# EAGLE design Whistler_Schematic_RevE (EAGLE 7.7.0)
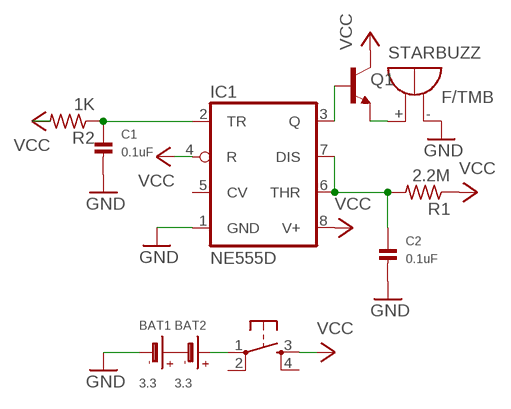
[diagram p0: schematic, sheet 1]

## Parts
BAT1  3.3  BATTERYCR1220_SMT  [CR1220]
BAT2  3.3  BATTERYCR1220_SMT  [CR1220]
C1  0.1uF  CAP_CERAMIC_0805  [_0805]
C2  0.1uF  CAP_CERAMIC_0805  [_0805]
IC1  NE555D  [SO08]
Q1  TRANS_NPN-MMBT2222AL  [SOT23-3]
R1  2.2M  R-US_R1206  [R1206]
R2  1K  R-US_R1206  [R1206]
S2  TAC_SWITCHSMD  [TACTILE-SWITCH-SMD]
STARBUZZ  F/TMB  [F/TMB]

## Nets
GND: BAT1.- C1.2 C2.2 IC1.1(GND) STARBUZZ.-
N$1: C2.1 IC1.6(THR) IC1.7(DIS) R1.2
N$2: C1.1 IC1.2(TR) R2.1
N$3: BAT1.+$1(+) BAT2.-
N$4: IC1.3(Q) Q1.1(B)
N$5: BAT2.+$1(+) S2.1
N$7: Q1.2(E) STARBUZZ.+
VCC: IC1.4(R) IC1.8(V+) Q1.3(C) R1.1 R2.2 S2.3
Unconnected: IC1.5(CV) S2.2 S2.4

## Library data of the parts
BAT1 BAT2 = microbuilder:BATTERY: CR1220 SMT - Digikey: 3001K-ND
C1 C2 = microbuilder:CAP_CERAMIC: Ceramic Capacitors 0402 - 0402 Surface Mount Capacitors 16pF 50V 5% [Digikey: 445-4899-2-ND] 18pF 50V 5% [Digikey: 490-1281-2-ND] 22pF 50V 5% [Digikey: 490-1283-2-ND] 68pF 50V 5% [Digikey: 490-1289-2-ND] 0.1uF 10V 10% [Digikey: 490-1318-2-ND] 1.0uF 6.3V 10% [Digikey: 490-1320-2-ND] 0603 - 0603 Surface Mount Capacitors 16 pF 50V 5% [Digikey: 445-5051-2-ND] 22 pF 50V [Digikey: PCC220ACVTR-ND] 33 pF 50V 5% [Digikey: 490-1415-1-ND] 56pF 50V 5% [Digikey: 490-1421-1-ND] 220pF 50V 5% [Digikey: 445-1285-1-ND] 680 pF 50V 2200 pF 50V 5% C0G [Digikey: 445-1297-1-ND] 5600 pF 100V 5% X7R [Digikey: 478-3711-1-ND] 0.1 µF 25V 10% [Digikey: PCC2277TR-ND] 0.22 µF 16V 10% X7R [Digikey: 445-1318-1-ND] 1.0 µF 25V 10% [Digikey: 445-5146-2-ND] 0603 - RF Specific 3pF 250V +/-0.1pF RF [Digikey: 712-1347-1-ND] 18 pF 250V 5% [Digikey: 478-3505-1-ND or 712-1322-1-ND] 56 pF 250V 5% C0G RF [Digikey: 490-4867-1-ND] 68 pF 250V RF [Digikey: 490-4868-1-ND] 0805 - 0805 Surface Mount Capacitors 220 pF 250V 2% RF Ceramic Capacitor [Digikey: 712-1398-1-ND] 1000 pF 50V 2% NP0 Ceramic Capacitor [Digikey: 478-3760-1-ND] 0.1 µF 25V 10% Ceramic Capacitor [Digikey: PCC1828TR-ND] 1.0 µF 16V 10% Ceramic Capacitor[Digikey: 490-1691-2-ND] 10.0 µF 10V 10% Ceramic Capacitor[Digikey: 709-1228-1-ND] 10.0 uF 16V 10% Ceramic Capacitor [Digikey: 478-5165-2-ND] 47 uF 6.3V 20% Ceramic Capacitor [Digikey: 587-1779-1-ND or 399-5506-1-ND] 1206 - 1206 Surface Mount Capacitors 47uF 10V 20% Ceramic Capacitor [Digikey: 490-5528-1-ND or 399-5508-1-ND or 445-6010-1-ND] 100uF 6.3V -20%, +80% Y5V Ceramic Capacitor (Digikey: 490-4512-1-ND, Mouser: 81-GRM31CF50J107ZE1L)
IC1 = linear:*555: TIMER
Q1 = SparkFun-DiscreteSemi:TRANS_NPN: NPN transistor Current controlled devices typically used to amplify current or used as a switch. BC547 - COM-08928 <http://www.sparkfun.com/products/8928> (TO-92 45V 100mA) (1.Collector 2.Base 3.Emitter) 2N3904 - COM-00521 <http://www.sparkfun.com/products/521> (TO-92 40V 200mA) (1.Emitter 2.Base 3.Collector) P2N2222A - COM-12852 <http://www.sparkfun.com/products/12852> (TO-92 40V 600mA) (1.Collector 2.Base 3.Emitter); PROD_ID: TRANS-08049; VALUE: 600mA/40V
R1 R2 = rcl:R-US_: RESISTOR, American symbol
S2 = SparkFun-Retired:TAC_SWITCH: Momentary Switch Button commonly used for reset or general input. Spark Fun Electronics SKU : COM-00097 SMT- SWCH-08247; PROD_ID: SWCH-08247
STARBUZZ = buzzer:F/TMB: BUZZER Source: Buerklin; OC_FARNELL: unknown; OC_NEWARK: unknown

## Board
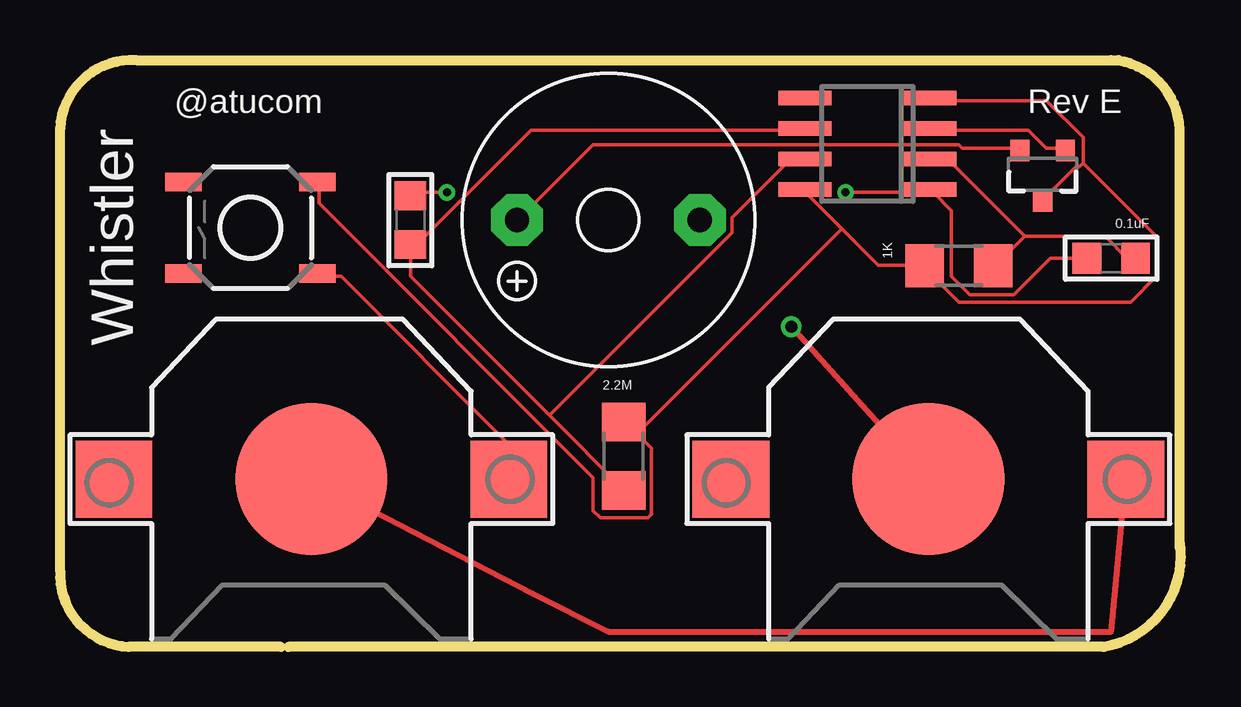
[diagram p1: board, top side]
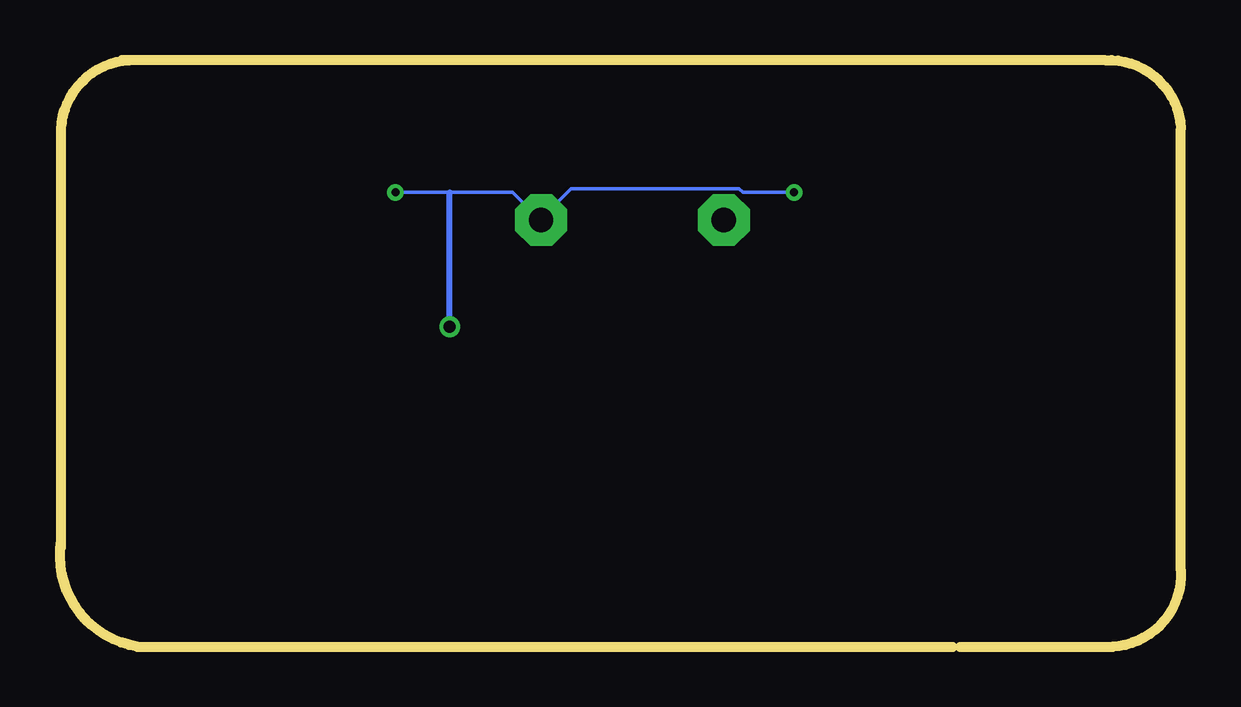
[diagram p2: board, bottom side, seen from below]

Size 46.73 x 24.45 mm. Coordinates in mm from the lower left corner, seen from the top.
Outline: 44.13,24.45 3.18,24.45 arc90 0,21.59 0,3.18 arc90 2.86,0 9.21,0
Outline: 9.53,0 43.5,0 arc90 46.67,4.45
Outline: 46.67,4.13 46.67,4.45
Outline: 46.67,4.45 46.67,21.27 arc90 43.82,24.45
Copper layers (1*16): Top 0.0356mm / dielectric 1.5011mm / Bottom 0.0356mm
Design rules "oshpark-2layer": minimum track width 6mil, minimum drill 13mil, track to track 6mil, track to pad 6mil, pad to pad 6mil, via to via 6mil, smd to smd 6mil, copper to edge 15mil, drill to drill 6mil, minimum pad ring 7mil, minimum via ring 7mil, stop-mask expansion 2.5mil, vias tented up to drill 0mil, thermal gap 10mil

### Footprints (pad centres in the part's own frame; a part is rotated, then mirrored left to right if it is on the bottom)
CR1220 = smd 3.2 x 3.2: +$1 -8.225,0; +$2 8.225,0 | smd 6.35 x 6.35: - 0,0
_0805 = smd 1.2 x 1.3: 1 -1.016,0; 2 1.016,0
SO08 = smd 0.6 x 2.2: 1 -1.905,-2.6; 2 -0.635,-2.6; 3 0.635,-2.6; 4 1.905,-2.6; 5 1.905,2.6; 6 0.635,2.6; 7 -0.635,2.6; 8 -1.905,2.6
SOT23-3 = smd 0.8 x 0.9: 1 -0.95,-1; 2 0.95,-1; 3 0,1.1
R1206 = smd 1.6 x 1.803: 1 -1.422,0; 2 1.422,0
TACTILE-SWITCH-SMD = smd 1.524 x 0.762: 1 -2.794,1.905; 2 2.794,1.905; 3 -2.794,-1.905; 4 2.794,-1.905
F/TMB = drill 1.016 pad 2.159 octagon: + 3.81,0; - -3.81,0

### Placement (x,y rotation side)
BAT1  36.2,6.98 180 top
BAT2  10.48,6.98 180 top
C1  43.82,16.19 180 top
C2  14.61,17.78 90 top
IC1  33.66,20.96 90 top
Q1  40.96,19.69 180 top
R1  23.5,7.94 270 top
R2  37.47,15.88 180 top
S2  7.94,17.46 180 top
STARBUZZ  22.86,17.78 180 top

### Tracks (layer width: path | path; a pad name or v marks a point on that pad's centre or on a via)
GND  (via drill 0.33, 0.5)
  Top 0.152: C1.2 41.28,16.19 39.75,14.67 37.92,14.67 37.16,15.43 37.16,18.17 36.4,18.94 IC1.1 36.25,18.94 v32.74,18.94 | v16.13,18.94 14.61,18.94 C2.2
  Top 0.254: BAT1.- v30.48,13.34
  Bottom 0.152: v16.13,18.94 18.26,18.94 18.42,19.09 25.43,19.09 26.65,17.87 STARBUZZ.- 26.8,17.87 27.87,18.94 30.48,18.94 v32.74,18.94
  Bottom 0.254: v30.48,13.34 30.48,18.94
N$1
  Top 0.152: 14.61,16.5 14.61,15.43 20.4,9.64 | 14.61,16.5 C2.1 14.61,16.65 | 20.4,9.64 23.45,6.59 R1.2 | 20.4,9.64 28.02,17.26 28.02,17.87 30.46,20.31 30.91,20.31 IC1.7 | 14.61,16.5 19.64,21.53 30.91,21.53 IC1.6
N$2
  Top 0.152: C1.1 44.48,16.19 43.56,17.11 40.21,17.11 | 40.21,17.11 38.99,15.89 R2.1 | 40.21,17.11 37.01,20.31 36.4,20.31 IC1.2
N$3
  Top 0.254: BAT2.- 19.69,2.22 22.86,0.63 43.82,0.63 BAT1.+$1
N$4
  Top 0.152: Q1.1 41.89,20.76 41.12,20.76 40.36,21.53 36.4,21.53 IC1.3
N$5
  Top 0.152: S2.1 10.8,15.43 11.71,15.43 18.57,8.57 18.57,7.05 BAT2.+$1
N$7
  Top 0.152: Q1.2 39.9,20.76 37.62,20.76 37.47,20.92 22.23,20.92 19.18,17.87 STARBUZZ.+
VCC
  Top 0.152: 42.65,20.15 42.5,20 42.34,20 40.97,18.63 Q1.3 | 42.65,20.15 42.65,21.22 41.12,22.75 36.4,22.75 IC1.4 | 32.59,17.41 31.07,18.94 IC1.8 | 32.59,17.41 34.11,15.89 35.94,15.89 R2.2 36.09,15.74 37.47,14.36 44.63,14.36 45.7,15.43 45.7,17.11 42.65,20.15 | 24.06,8.88 23.6,9.33 R1.1 24.06,8.88 | 24.06,8.88 24.66,8.27 24.66,5.52 24.51,5.37 22.53,5.37 22.23,5.68 22.23,7.05 10.8,18.48 10.8,19.24 S2.3 | 24.06,8.88 32.59,17.41

### Text on the board
tPlace: Whistler | @atucom | Rev E